# EAGLE design CustomDevBoard-v0.1 (EAGLE 5.08)
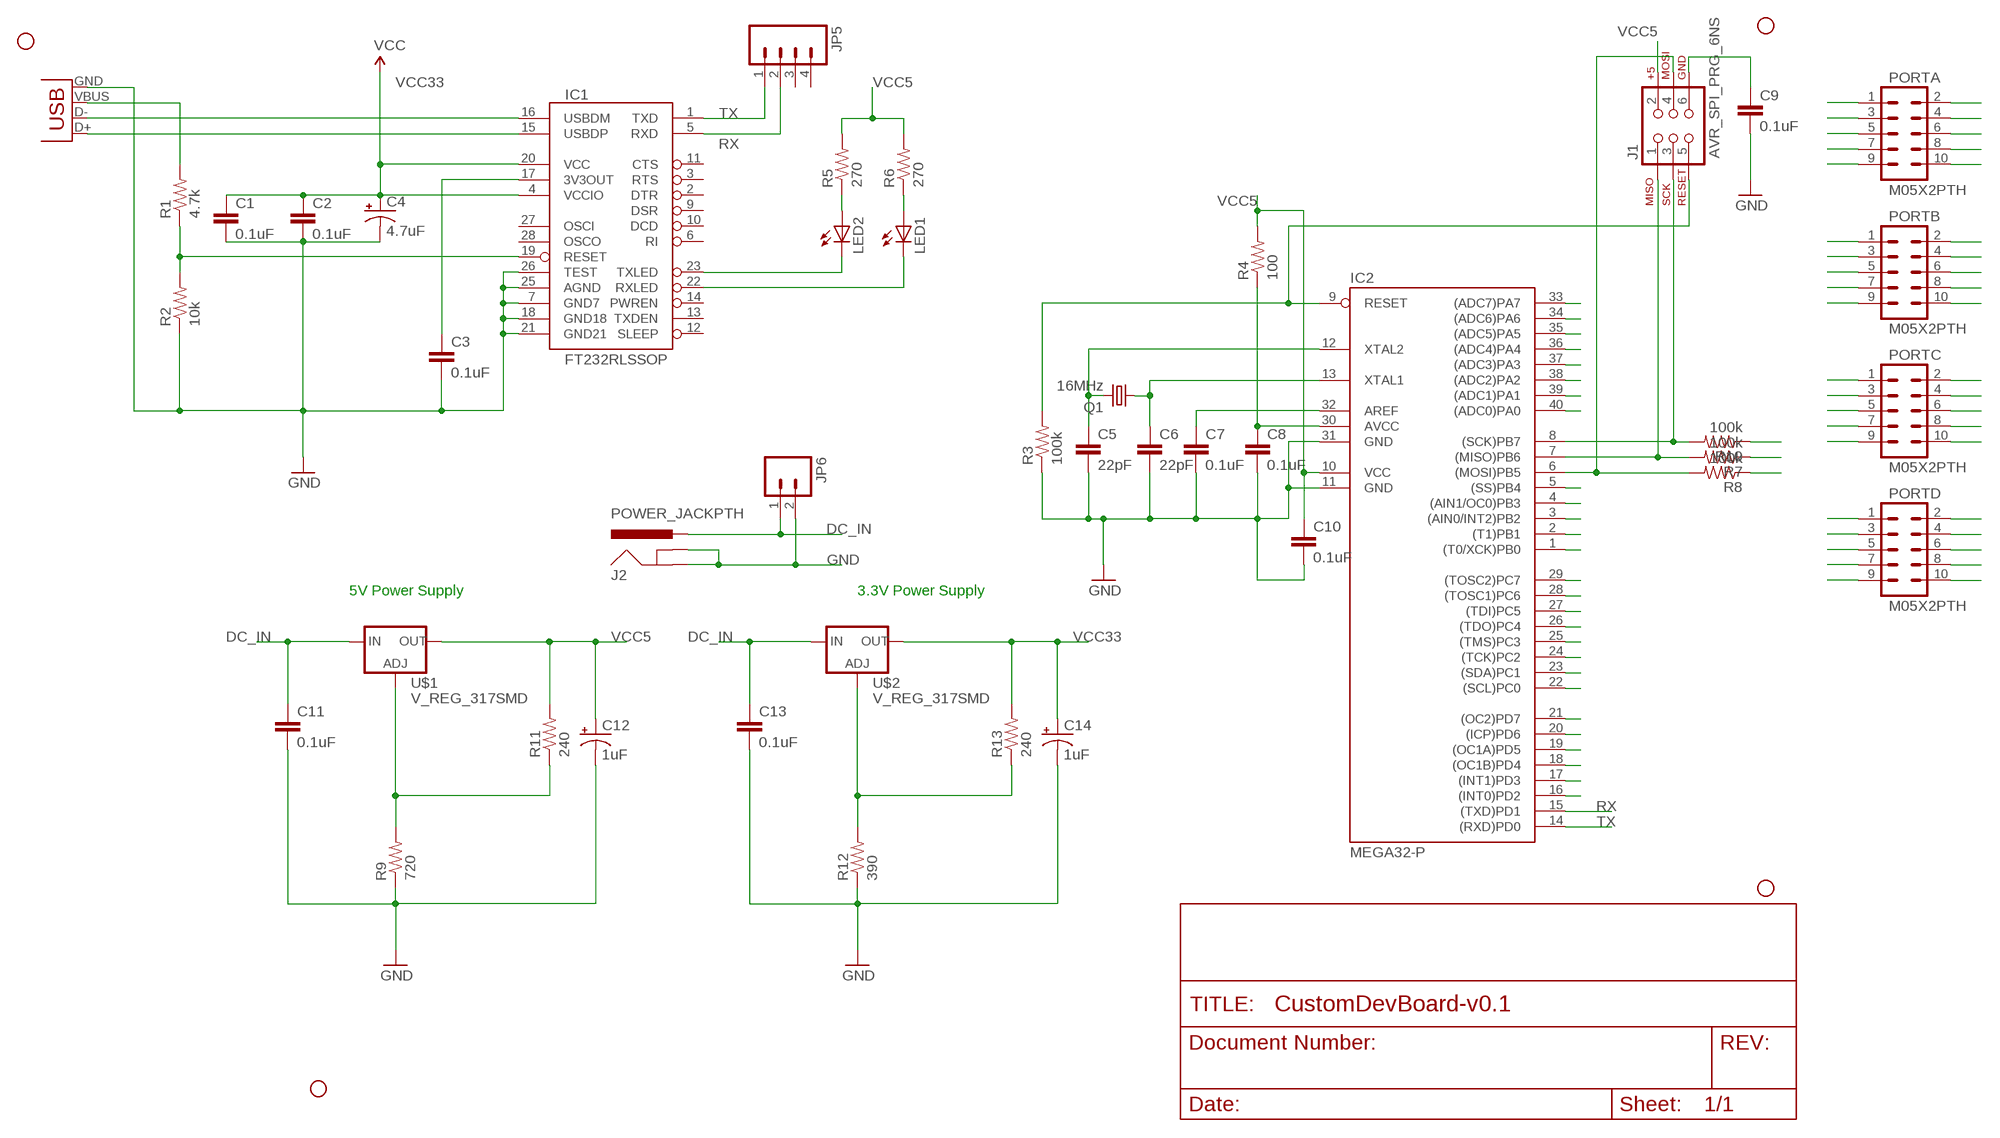
[diagram p0: schematic, sheet 1]

## Parts
C1  0.1uF  CAP0805  [0805]
C2  0.1uF  CAP0805  [0805]
C3  0.1uF  CAP0805  [0805]
C4  4.7uF  CAP_POL1206  [EIA3216]
C5  22pF  CAP0805  [0805]
C6  22pF  CAP0805  [0805]
C7  0.1uF  CAP0805  [0805]
C8  0.1uF  CAP0805  [0805]
C9  0.1uF  CAP0805  [0805]
C10  0.1uF  CAP0805  [0805]
C11  0.1uF  CAP0805  [0805]
C12  1uF  CAP_POL1206  [EIA3216]
C13  0.1uF  CAP0805  [0805]
C14  1uF  CAP_POL1206  [EIA3216]
IC1  FT232RLSSOP  [SSOP28DB]
IC2  MEGA32-P  [DIL40]
J1  AVR_SPI_PRG_6NS  [2X3-NS]
J2  POWER_JACKPTH  [POWER_JACK_PTH]
JP1  STAND-OFF  [STAND-OFF]
JP2  STAND-OFF  [STAND-OFF]
JP3  STAND-OFF  [STAND-OFF]
JP4  STAND-OFF  [STAND-OFF]
JP5  M04PTH  [1X04]
JP6  M025MM  [SCREWTERMINAL-5MM-2]
LED1  LED1206  [LED-1206]
LED2  LED1206  [LED-1206]
PORTA  M05X2PTH  [AVR_ICSP]
PORTB  M05X2PTH  [AVR_ICSP]
PORTC  M05X2PTH  [AVR_ICSP]
PORTD  M05X2PTH  [AVR_ICSP]
Q1  16MHz  CRYSTALHC49UV  [HC49U-V]
R1  4.7k  RESISTOR  [0805]
R2  10k  RESISTOR  [0805]
R3  100k  RESISTOR  [0805]
R4  100  RESISTOR  [0805]
R5  270  RESISTOR  [0805]
R6  270  RESISTOR  [0805]
R7  100k  RESISTOR  [0805]
R8  100k  RESISTOR  [0805]
R9  720  RESISTOR  [0805]
R10  100k  RESISTOR  [0805]
R11  240  RESISTOR  [0805]
R12  390  RESISTOR  [0805]
R13  240  RESISTOR  [0805]
U$1  V_REG_317SMD  [SOT223]
U$2  V_REG_317SMD  [SOT223]
X1  USBPTH  [USB-B-PTH]

## Nets
A0: IC2.40((ADC0)PA0) PORTA.1
A1: IC2.39((ADC1)PA1) PORTA.2
A2: IC2.38((ADC2)PA2) PORTA.3
A3: IC2.37((ADC3)PA3) PORTA.4
A4: IC2.36((ADC4)PA4) PORTA.5
A5: IC2.35((ADC5)PA5) PORTA.6
A6: IC2.34((ADC6)PA6) PORTA.7
A7: IC2.33((ADC7)PA7) PORTA.8
B0: IC2.1((T0/XCK)PB0) PORTB.1
B1: IC2.2((T1)PB1) PORTB.2
B2: IC2.3((AIN0/INT2)PB2) PORTB.3
B3: IC2.4((AIN1/OC0)PB3) PORTB.4
B4: IC2.5((SS)PB4) PORTB.5
B5: PORTB.6 R8.1
B6: PORTB.7 R7.1
B7: PORTB.8 R10.1
C0: IC2.22((SCL)PC0) PORTC.1
C1: IC2.23((SDA)PC1) PORTC.2
C2: IC2.24((TCK)PC2) PORTC.3
C3: IC2.25((TMS)PC3) PORTC.4
C4: IC2.26((TDO)PC4) PORTC.5
C5: IC2.27((TDI)PC5) PORTC.6
C6: IC2.28((TOSC1)PC6) PORTC.7
C7: IC2.29((TOSC2)PC7) PORTC.8
D0: PORTD.1
D1: PORTD.2
D2: IC2.16((INT0)PD2) PORTD.3
D3: IC2.17((INT1)PD3) PORTD.4
D4: IC2.18((OC1B)PD4) PORTD.5
D5: IC2.19((OC1A)PD5) PORTD.6
D6: IC2.20((ICP)PD6) PORTD.7
D7: IC2.21((OC2)PD7) PORTD.8
DC_IN: C11.1 C13.1 J2.PWR JP6.1 U$1.3(IN) U$2.3(IN)
GND: C1.2 C2.2 C3.2 C4.C(-) C5.2 C6.2 C7.2 C8.2 C9.2 C10.2 C11.2 C12.C(-) C13.2 C14.C(-) IC1.7(GND7) IC1.18(GND18) IC1.21(GND21) IC1.25(AGND) IC1.26(TEST) IC2.11(GND) IC2.31(GND) J2.GND J2.GNDBREAK JP6.2 PORTA.10 PORTB.10 PORTC.10 PORTD.10 R2.1 R3.1 R9.1 R12.1 X1.GND
N$1: IC1.15(USBDP) X1.D+
N$2: IC1.16(USBDM) X1.D-
N$3: R1.2 X1.VBUS
N$4: IC1.19(RESET) R1.1 R2.2
N$5: R12.2 R13.1 U$2.1(ADJ)
N$6: IC2.8((SCK)PB7) J1.3 R10.2
N$7: IC2.9(RESET) J1.5 R3.2
N$8: C3.1 IC1.17(3V3OUT)
N$9: IC2.6((MOSI)PB5) J1.4 R8.2
N$10: C9.1 J1.6
N$11: C5.1 IC2.12(XTAL2) Q1.2
N$12: C6.1 IC2.13(XTAL1) Q1.1
N$13: IC1.23(TXLED) LED2.C
N$14: LED2.A R5.1
N$15: LED1.A R6.1
N$16: C7.1 IC2.32(AREF)
N$17: C8.1 IC2.30(AVCC) R4.1
N$18: IC1.22(RXLED) LED1.C
N$19: IC2.7((MISO)PB6) J1.1 R7.2
N$21: R9.2 R11.1 U$1.1(ADJ)
RX: IC1.5(RXD) IC2.15((TXD)PD1) JP5.2
TX: IC1.1(TXD) IC2.14((RXD)PD0) JP5.1
VCC5: C10.1 C12.A(+) IC2.10(VCC) J1.2 PORTA.9 PORTB.9 PORTC.9 PORTD.9 R4.2 R5.2 R6.2 R11.2 U$1.2(OUT)
VCC33: C1.1 C2.1 C4.A(+) C14.A(+) IC1.4(VCCIO) IC1.20(VCC) R13.2 U$2.2(OUT) ; supply symbol labelled VCC
Unconnected: IC1.2(DTR) IC1.3(RTS) IC1.6(RI) IC1.9(DSR) IC1.10(DCD) IC1.11(CTS) IC1.12(SLEEP) IC1.13(TXDEN) IC1.14(PWREN) IC1.27(OSCI) IC1.28(OSCO) JP5.3 JP5.4

## Notes on the sheet
- 5V Power Supply | 3.3V Power Supply

## Library data of the parts
C1-C3 C5-C11 C13 = SparkFun:CAP: Capacitor Standard 0603 ceramic capacitor, and 0.1" leaded capacitor.
C4 C12 C14 = SparkFun:CAP_POL: Capacitor Polarized These are standard SMD and PTH capacitors. Normally 10uF, 47uF, and 100uF in electrolytic and tantalum varieties. Always verify the external diameter of the through hole cap, it varies with capacity, voltage, and manufacturer. The EIA devices should be standard.
IC1 = SparkFun:FT232RL: USB UART FT232RL 4th Generation USB UART (USB <-> Serial) Controller. Spark Fun Electronics SKU : COM-00650
IC2 = atmel:MEGA32-P: MICROCONTROLLER 32 Kbytes FLASH 2 Kbytes SRAM 1 Kbytes EEPROM USART 8-channel 10 bit ADC Source: www.atmel.com .. doc2503.pdf
J1 = SparkFun:AVR_SPI_PRG_6: AVR ISP 6 Pin This is the reduced ISP connector for AVR programming. Common on Arduino. This footprint will take up less PCB space and can be used with a 10-pin to 6-pin adapter such as SKU: BOB-08508
J2 = SparkFun:POWER_JACK: Power Jack This is the standard 5.5mm barrel jack for power. The PTH is the most common, proven, reliable, footprint. All others are experimental. The Slot footprint only works if the mill layer is transmitted to the PCB fab house so be warned. Spark Fun Electronics SKU : PRT-00119. Mating wall wart : TOL-00298 (and others)
JP1-JP4 = SparkFun:STAND-OFF: Stand Off This is the mechanical footprint for a #4 phillips button head screw. Use the keepout ring to avoid running the screw head into surrounding components. SKU : PRT-00447
JP5 = SparkFun:M04: Header 4 Standard 4-pin 0.1" header. Use with straight break away headers (SKU : PRT-00116), right angle break away headers (PRT-00553), swiss pins (PRT-00743), machine pins (PRT-00117), and female headers (PRT-00115). Molex polarized connector foot print use with SKU : PRT-08231 with associated crimp pins and housings.
JP6 = SparkFun:M02: Header 2 Standard 2-pin 0.1" header. Use with straight break away headers (SKU : PRT-00116), right angle break away headers (PRT-00553), swiss pins (PRT-00743), machine pins (PRT-00117), and female headers (PRT-00115). Molex polarized connector foot print use with SKU : PRT-08233 with associated crimp pins and housings.
LED1 LED2 = SparkFun:LED: LEDs Standard schematic elements and footprints for 5mm, 3mm, 1206, and 0603 sized LEDs. 5mm - Spark Fun Electronics SKU : COM-00529 (and others)
PORTA PORTB PORTC PORTD = SparkFun:M05X2: Header 5x2 Standard 10-pin dual row 0.1" header. Commonly used with AVR-ISP. Use with Spark Fun Electronics SKU: PRT-00778
Q1 = SparkFun:CRYSTAL: Crystals Various standard crystals. Proven footprints. Spark Fun Electronics SKU : COM-00534
R1-R13 = SparkFun:RESISTOR: Resistor Basic schematic elements and footprints for 0603, 1206, and PTH 1/10th watt (small) resistors.
U$1 U$2 = SparkFun:V_REG_317: Voltage Regulator Standard LM317 adjustable voltage regulator. AOI (Adjust Output Input). Google 'LM317 Calculator' for easy to use app to get the two resistor values needed. 240/720 for 5V output. 240/390 for 3.3V output. Spark Fun Electronics SKU : COM-00527
X1 = SparkFun:USB: USB Connectors USB-B-PTH is fully proven SKU : PRT-00139 USB-miniB is fully proven SKU : PRT-00587 USB-A-PCB is untested. USB-A-H is throughly reviewed, but untested. Spark Fun Electronics SKU : PRT-00437 USB-B-SMT is throughly reviewed, but untested. Needs silkscreen touching up. USB-A-S has not been used/tested USB-MB-H has not been used/tested

## Board
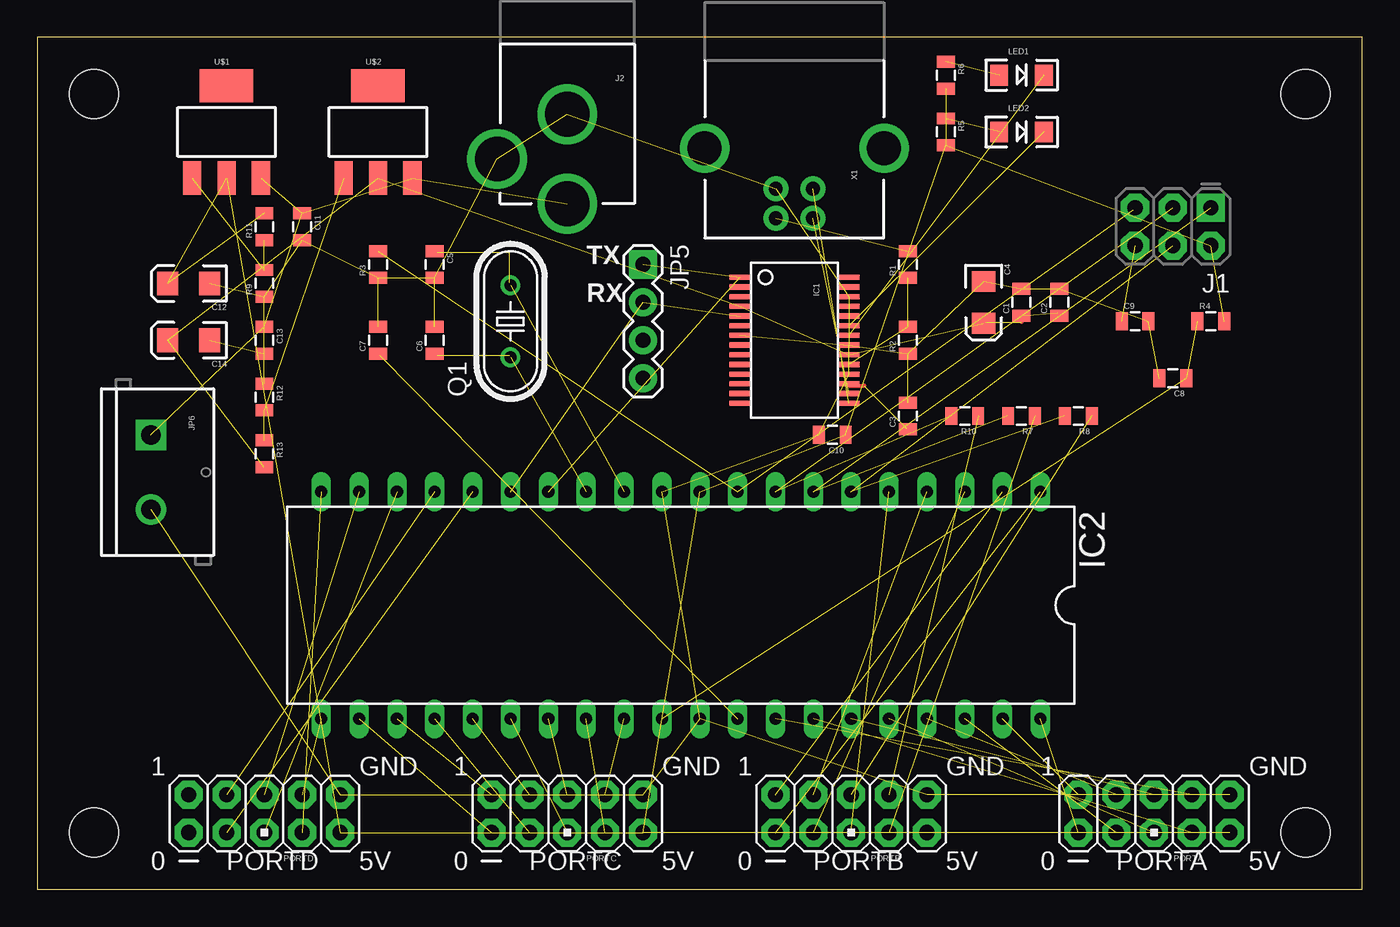
[diagram p1: board, top side]
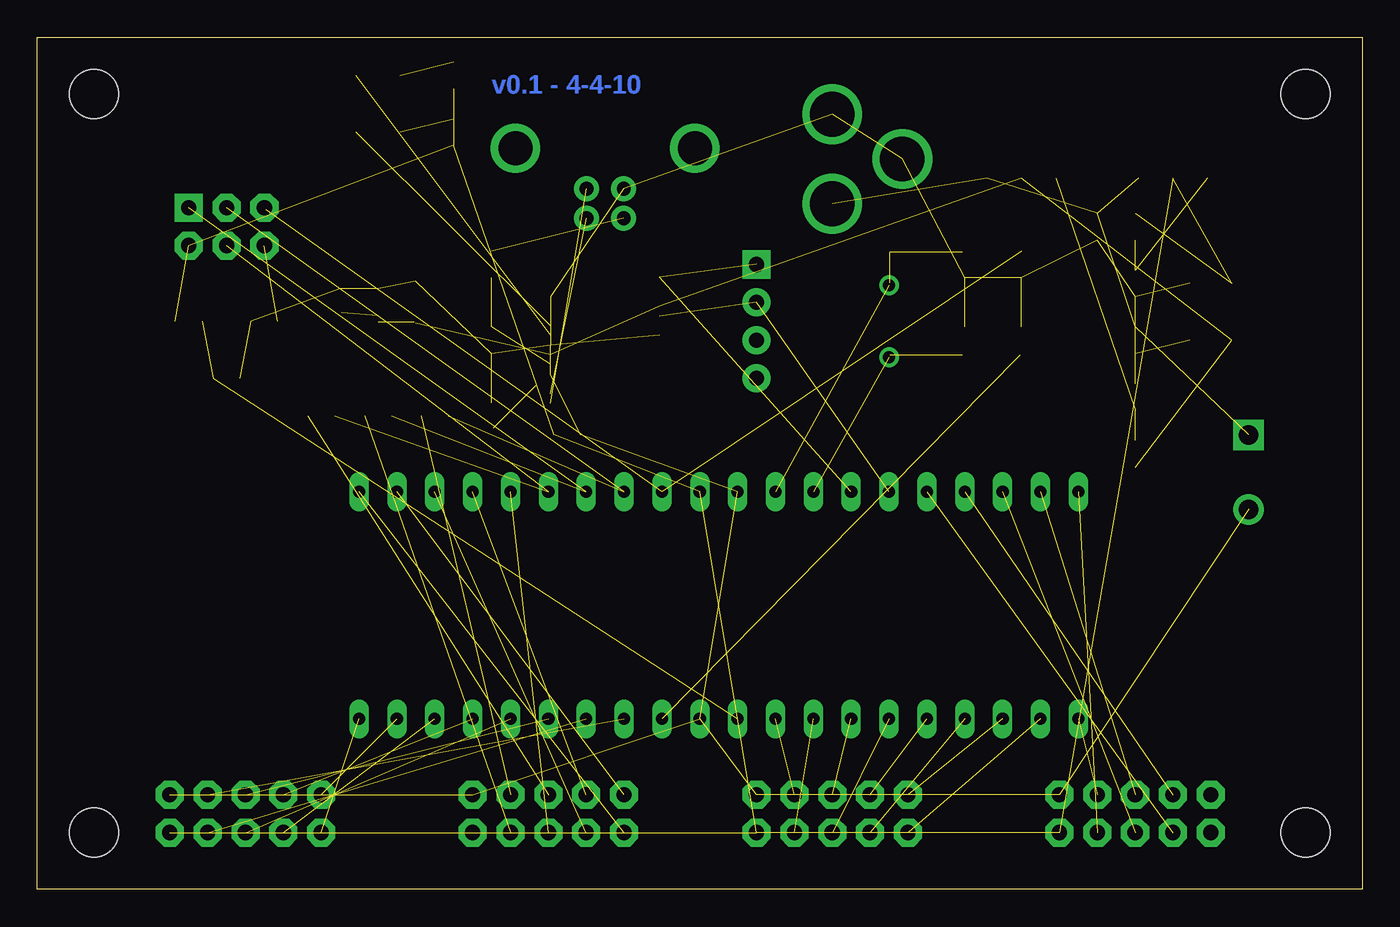
[diagram p2: board, bottom side, seen from below]

Size 88.9 x 57.15 mm. Coordinates in mm from the lower left corner, seen from the top.
Outline: 0,0 88.9,0 88.9,57.15 0,57.15 0,0
Copper layers (1*16): Top 0.035mm / dielectric 1.5mm / Bottom 0.035mm
Design rules "default": minimum track width 10mil, minimum drill 24mil, track to track 8mil, track to pad 8mil, pad to pad 8mil, via to via 8mil, smd to smd 8mil, copper to edge 40mil, drill to drill 8mil, minimum pad ring 10mil, minimum via ring 8mil, stop-mask expansion 4mil, vias tented up to drill 0mil, thermal gap 10mil

### Footprints (pad centres in the part's own frame; a part is rotated, then mirrored left to right if it is on the bottom)
0805 = smd 0.8 x 1.2: 1 -0.9,0; 2 0.9,0
EIA3216 = smd 1.4 x 1.6: A 1.4,0; C -1.4,0
SSOP28DB = smd 0.348 x 1.397: 1 -4.225,-3.656; 2 -3.575,-3.656; 3 -2.925,-3.656; 4 -2.275,-3.656; 5 -1.625,-3.656; 6 -0.975,-3.656; 7 -0.325,-3.656; 8 0.325,-3.656; 9 0.975,-3.656; 10 1.625,-3.656; 11 2.275,-3.656; 12 2.925,-3.656; 13 3.575,-3.656; 14 4.225,-3.656; 15 4.225,3.656; 16 3.575,3.656; 17 2.925,3.656; 18 2.275,3.656; 19 1.625,3.656; 20 0.975,3.656; 21 0.325,3.656; 22 -0.325,3.656; 23 -0.975,3.656; 24 -1.625,3.656; 25 -2.275,3.656; 26 -2.925,3.656; 27 -3.575,3.656; 28 -4.225,3.656
DIL40 = drill 0.813 long: 1 -24.13,-7.62; 2 -21.59,-7.62; 3 -19.05,-7.62; 4 -16.51,-7.62; 5 -13.97,-7.62; 6 -11.43,-7.62; 7 -8.89,-7.62; 8 -6.35,-7.62; 9 -3.81,-7.62; 10 -1.27,-7.62; 11 1.27,-7.62; 12 3.81,-7.62; 13 6.35,-7.62; 14 8.89,-7.62; 15 11.43,-7.62; 16 13.97,-7.62; 17 16.51,-7.62; 18 19.05,-7.62; 19 21.59,-7.62; 20 24.13,-7.62; 21 24.13,7.62; 22 21.59,7.62; 23 19.05,7.62; 24 16.51,7.62; 25 13.97,7.62; 26 11.43,7.62; 27 8.89,7.62; 28 6.35,7.62; 29 3.81,7.62; 30 1.27,7.62; 31 -1.27,7.62; 32 -3.81,7.62; 33 -6.35,7.62; 34 -8.89,7.62; 35 -11.43,7.62; 36 -13.97,7.62; 37 -16.51,7.62; 38 -19.05,7.62; 39 -21.59,7.62; 40 -24.13,7.62
2X3-NS = drill 1.016 pad 1.88 square: 1 -2.54,-1.27 | drill 1.016 pad 1.88 octagon: 2 -2.54,1.27; 3 0,-1.27; 4 0,1.27; 5 2.54,-1.27; 6 2.54,1.27
POWER_JACK_PTH = drill 2.997 round: GND 0,7.7; GNDBREAK 4.7,10.7; PWR 0,13.7
STAND-OFF = hole 3.302: 0,0
1X04 = drill 1.016 pad 1.88 square: 1 0,0 | drill 1.016 pad 1.88 round: 2 2.54,0; 3 5.08,0; 4 7.62,0
SCREWTERMINAL-5MM-2 = drill 1.3 pad 2.032 square: 1 0,0 | drill 1.3 pad 2.032 round: 2 5,0
LED-1206 = smd 1.2 x 1.4: A -1.5,0; C 1.5,0
AVR_ICSP = drill 1.016 pad 1.88 octagon: 1 -1.27,5.08; 2 1.27,5.08; 3 -1.27,2.54; 4 1.27,2.54; 5 -1.27,0; 6 1.27,0; 7 -1.27,-2.54; 8 1.27,-2.54; 9 -1.27,-5.08; 10 1.27,-5.08
HC49U-V = drill 0.813 round: 1 -2.413,0; 2 2.413,0
SOT223 = smd 1.219 x 2.235: 1 -2.311,-3.099; 2 0,-3.099; 3 2.311,-3.099 | smd 3.6 x 2.2: 4 0,3.099
USB-B-PTH = drill 0.914 pad 1.676 round: D+ 0,1.25; D- 1.981,1.25; GND 0,-1.25; VBUS 1.981,-1.25 | drill 2.286 round: P$1 -2.718,-6.02; P$2 -2.718,6.02

### Placement (x,y rotation side)
C1  66.04,39.37 90 top
C2  68.58,39.37 90 top
C3  58.42,31.75 90 top
C4  63.5,39.37 270 top
C5  26.67,41.91 270 top
C6  26.67,36.83 90 top
C7  22.86,36.83 90 top
C8  76.2,34.29 180 top
C9  73.66,38.1 0 top
C10  53.34,30.48 180 top
C11  17.78,44.45 270 top
C12  10.16,40.64 180 top
C13  15.24,36.83 270 top
C14  10.16,36.83 180 top
IC1  50.8,36.83 270 top
IC2  43.18,19.05 180 top
J1  76.2,44.45 180 top
J2  35.56,59.69 180 top
JP1  85.09,53.34 0 top
JP2  85.09,3.81 0 top
JP3  3.81,53.34 0 top
JP4  3.81,3.81 0 top
JP5  40.64,41.91 270 top
JP6  7.62,30.48 270 top
LED1  66.04,54.61 0 top
LED2  66.04,50.8 0 top
PORTA  74.93,5.08 90 top
PORTB  54.61,5.08 90 top
PORTC  35.56,5.08 90 top
PORTD  15.24,5.08 90 top
Q1  31.75,38.1 90 top
R1  58.42,41.91 90 top
R2  58.42,36.83 90 top
R3  22.86,41.91 90 top
R4  78.74,38.1 0 top
R5  60.96,50.8 270 top
R6  60.96,54.61 270 top
R7  66.04,31.75 180 top
R8  69.85,31.75 180 top
R9  15.24,40.64 90 top
R10  62.23,31.75 180 top
R11  15.24,44.45 90 top
R12  15.24,33.02 270 top
R13  15.24,29.21 270 top
U$1  12.7,50.8 0 top
U$2  22.86,50.8 0 top
X1  50.8,46.99 270 top

### Tracks (layer width: path | path; a pad name or v marks a point on that pad's centre or on a via)
A0  (1 unrouted)
A1  (1 unrouted)
A2  (1 unrouted)
A3  (1 unrouted)
A4  (1 unrouted)
A5  (1 unrouted)
A6  (1 unrouted)
A7  (1 unrouted)
B0  (1 unrouted)
B1  (1 unrouted)
B2  (1 unrouted)
B3  (1 unrouted)
B4  (1 unrouted)
B5  (1 unrouted)
B6  (1 unrouted)
B7  (1 unrouted)
C0  (1 unrouted)
C1  (1 unrouted)
C2  (1 unrouted)
C3  (1 unrouted)
C4  (1 unrouted)
C5  (1 unrouted)
C6  (1 unrouted)
C7  (1 unrouted)
D2  (1 unrouted)
D3  (1 unrouted)
D4  (1 unrouted)
D5  (1 unrouted)
D6  (1 unrouted)
D7  (1 unrouted)
DC_IN  (5 unrouted)
GND  (32 unrouted)
N$1  (1 unrouted)
N$2  (1 unrouted)
N$3  (1 unrouted)
N$4  (2 unrouted)
N$5  (2 unrouted)
N$6  (2 unrouted)
N$7  (2 unrouted)
  Bottom 0.254: 73.56,45.57 J1.5
N$8  (1 unrouted)
  Top 0.254: 55.47,33.78 54.46,33.78 IC1.17 | 58.32,30.94 C3.1
N$9  (2 unrouted)
N$10  (1 unrouted)
N$11  (3 unrouted)
  Top 0.254: Q1.2 31.7,40.69 | C5.1 26.82,42.72
N$12  (2 unrouted)
  Top 0.254: C6.1 26.82,35.81 | Q1.1 31.7,35.81
N$13  (1 unrouted)
N$14  (1 unrouted)
N$15  (1 unrouted)
N$16  (1 unrouted)
  Top 0.254: C7.1 22.96,35.81
N$17  (2 unrouted)
N$18  (1 unrouted)
N$19  (2 unrouted)
N$21  (2 unrouted)
RX  (2 unrouted)
TX  (2 unrouted)
VCC5  (12 unrouted)
VCC33  (7 unrouted)
  Top 0.254: 66.04,38.66 C1.1 66.04,38.05 | 68.48,38.66 C2.1 | C4.A 63.6,38.05

### Text on the board
Bottom: v0.1 - 4-4-10
tPlace: TX | RX | 1 | GND | 1 | GND | 1 | GND | 1 | GND | 0 | PORTD | 5V | 0 | PORTC | 5V | 0 | PORTB | 5V | 0 | PORTA | 5V